# EAGLE design water_project (EAGLE 9.4.2)
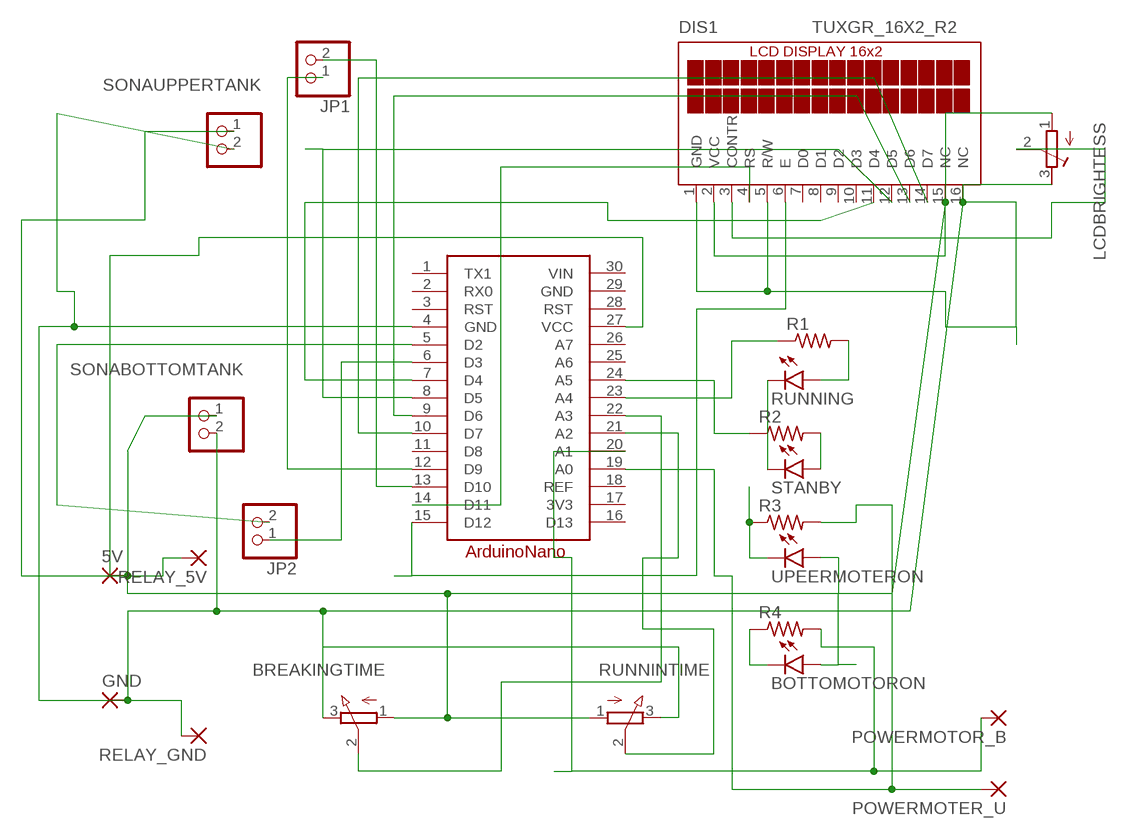
[diagram p0: schematic, sheet 1]

## Parts
5V  3,17/1,3  [3,17/1,3]
A1  ARDUINONANO  [ARDUINONANO]
BOTTOMOTORON  LEDSFH480  [SFH480]
BREAKINGTIME  3RP/1610N  [3RP/1610N]
DIS1  TUXGR_16X2_R2  [TUXGR_16X2_R2]
GND  3,17/1,3  [3,17/1,3]
JP1  PINHD-1X2  [1X02]
JP2  PINHD-1X2  [1X02]
LCDBRIGHTESS  R-TRIMM3339P  [RTRIM3339P]
POWERMOTER_U  3,17/1,3  [3,17/1,3]
POWERMOTOR_B  3,17/1,3  [3,17/1,3]
R1  R-US_0207/7  [0207/7]
R2  R-US_0207/7  [0207/7]
R3  R-US_0207/7  [0207/7]
R4  R-US_0207/7  [0207/7]
RELAY_5V  3,17/1,3  [3,17/1,3]
RELAY_GND  3,17/1,3  [3,17/1,3]
RUNNING  LEDSFH480  [SFH480]
RUNNINTIME  3RP/1610N  [3RP/1610N]
SONABOTTOMTANK  PINHD-1X2  [1X02]
SONAUPPERTANK  PINHD-1X2  [1X02]
STANBY  LEDSFH480  [SFH480]
UPEERMOTERON  LEDSFH480  [SFH480]

## Nets
ECHO: A1.13(D10) JP1.2
ECHO1: A1.5(D2) JP2.2
GND: A1.4(GND) BREAKINGTIME.3(E) DIS1.1(GND) DIS1.5(R/W) DIS1.16(NC) GND.1(P) LCDBRIGHTESS.3(E) RELAY_GND.1(P) RUNNINTIME.3(E) SONABOTTOMTANK.2 SONAUPPERTANK.2
N$1: R1.2 RUNNING.A
N$2: R2.2 STANBY.A
N$3: BOTTOMOTORON.K(C) R4.1
N$5: DIS1.3(CONTR) LCDBRIGHTESS.2(S)
N$6: A1.7(D4) DIS1.11(D4)
N$7: A1.8(D5) DIS1.12(D5)
N$8: A1.9(D6) DIS1.13(D6)
N$9: A1.10(D7) DIS1.14(D7)
N$10: RUNNING.K(C) STANBY.K(C)
N$11: A1.14(D11) DIS1.4(RS)
N$12: A1.15(D12) DIS1.6(E)
N$15: A1.21(A2) RUNNINTIME.2(S)
N$16: A1.22(A3) BREAKINGTIME.2(S)
N$17: A1.19(A0) POWERMOTER_U.1(P) R3.2
N$18: A1.20(A1) POWERMOTOR_B.1(P) R4.2
N$19: A1.23(A4) R1.1
N$20: A1.24(A5) R2.1
N$21: R3.1 UPEERMOTERON.K(C)
TRIG: A1.12(D9) JP1.1
TRIG1: A1.6(D3) JP2.1
VCC: 5V.1(P) A1.27(VCC) BOTTOMOTORON.A BREAKINGTIME.1(A) DIS1.2(VCC) DIS1.15(NC) LCDBRIGHTESS.1(A) RELAY_5V.1(P) RUNNINTIME.1(A) SONABOTTOMTANK.1 SONAUPPERTANK.1 UPEERMOTERON.A
Unconnected: A1.1(TX1) A1.2(RX0) A1.3(RST) A1.11(D8) A1.16(D13) A1.25(A6) A1.26(A7) A1.28(RST) DIS1.7(D0) DIS1.8(D1) DIS1.9(D2) DIS1.10(D3)

## Power pins joined to a net without a drawn wire
3V3: A1.17(3V3)
GND: A1.29(GND)
REF: A1.18(REF)
VIN: A1.30(VIN)

## Library data of the parts
5V GND POWERMOTER_U POWERMOTOR_B RELAY_5V RELAY_GND = wirepad:3,17/1,3: THROUGH-HOLE PAD
A1 = ArduinoNano:ARDUINONANO
BOTTOMOTORON RUNNING STANBY UPEERMOTERON = led:LED: LED OSRAM: - CHIPLED LG R971, LG N971, LY N971, LG Q971, LY Q971, LO R971, LY R971 LH N974, LH R974 LS Q976, LO Q976, LY Q976 LO Q996 - Hyper CHIPLED LW Q18S LB Q993, LB Q99A, LB R99A - SideLED LS A670, LO A670, LY A670, LG A670, LP A670 LB A673, LV A673, LT A673, LW A673 LH A674 LY A675 LS A676, LA A676, LO A676, LY A676, LW A676 LS A679, LY A679, LG A679 - Hyper Micro SIDELED® LS Y876, LA Y876, LO Y876, LY Y876 LT Y87S - SmartLED LW L88C, LW L88S LB L89C, LB L89S, LG L890 LS L89K, LO L89K, LY L89K LS L896, LA L896, LO L896, LY L896 - TOPLED LS T670, LO T670, LY T670, LG T670, LP T670 LSG T670, LSP T670, LSY T670, LOP T670, LYG T670 LG T671, LOG T671, LSG T671 LB T673, LV T673, LT T673, LW T673 LH T674 LS T676, LA T676, LO T676, LY T676, LB T676, LH T676, LSB T676, LW T676 LB T67C, LV T67C, LT T67C, LS T67K, LO T67K, LY T67K, LW E67C LS E67B, LA E67B, LO E67B, LY E67B, LB E67C, LV E67C, LT E67C LW T67C LS T679, LY T679, LG T679 LS T770, LO T770, LY T770, LG T770, LP T770 LB T773, LV T773, LT T773, LW T773 LH T774 LS E675, LA E675, LY E675, LS T675 LS T776, LA T776, LO T776, LY T776, LB T776 LHGB T686 LT T68C, LB T68C - Hyper Mini TOPLED® LB M676 - Mini TOPLED Santana® LG M470 LS M47K, LO M47K, LY M47K Source: http://www.osram.convergy.de LUXEON: - LUMILED® LXK2-PW12-R00, LXK2-PW12-S00, LXK2-PW14-U00, LXK2-PW14-V00 LXK2-PM12-R00, LXK2-PM12-S00, LXK2-PM14-U00 LXK2-PE12-Q00, LXK2-PE12-R00, LXK2-PE12-S00, LXK2-PE14-T00, LXK2-PE14-U00 LXK2-PB12-K00, LXK2-PB12-L00, LXK2-PB12-M00, LXK2-PB14-N00, LXK2-PB14-P00, LXK2-PB14-Q00 LXK2-PR12-L00, LXK2-PR12-M00, LXK2-PR14-Q00, LXK2-PR14-R00 LXK2-PD12-Q00, LXK2-PD12-R00, LXK2-PD12-S00 LXK2-PH12-R00, LXK2-PH12-S00 LXK2-PL12-P00, LXK2-PL12-Q00, LXK2-PL12-R00 Source: www.luxeon.com KINGBRIGHT: KA-3528ASYC Source: www.kingbright.com
BREAKINGTIME RUNNINTIME = pot:3RP/1610N: 16mm Potentiometer one level Source: http://www.alphapotentiometers.net/html/16mm_pot_2.html
DIS1 = display-lcd:TUXGR_16X2_R2: Tuxgraphics LCD display 16x2 characters reflective, without background light Source: tuxgr_12x2_r2.pdf; OC_FARNELL: unknown; OC_NEWARK: unknown
JP1 JP2 SONABOTTOMTANK SONAUPPERTANK = pinhead:PINHD-1X2: PIN HEADER
LCDBRIGHTESS = resistor:R-TRIMM: Trimm resistor
R1-R4 = resistor:R-US_: RESISTOR, American symbol

## Board
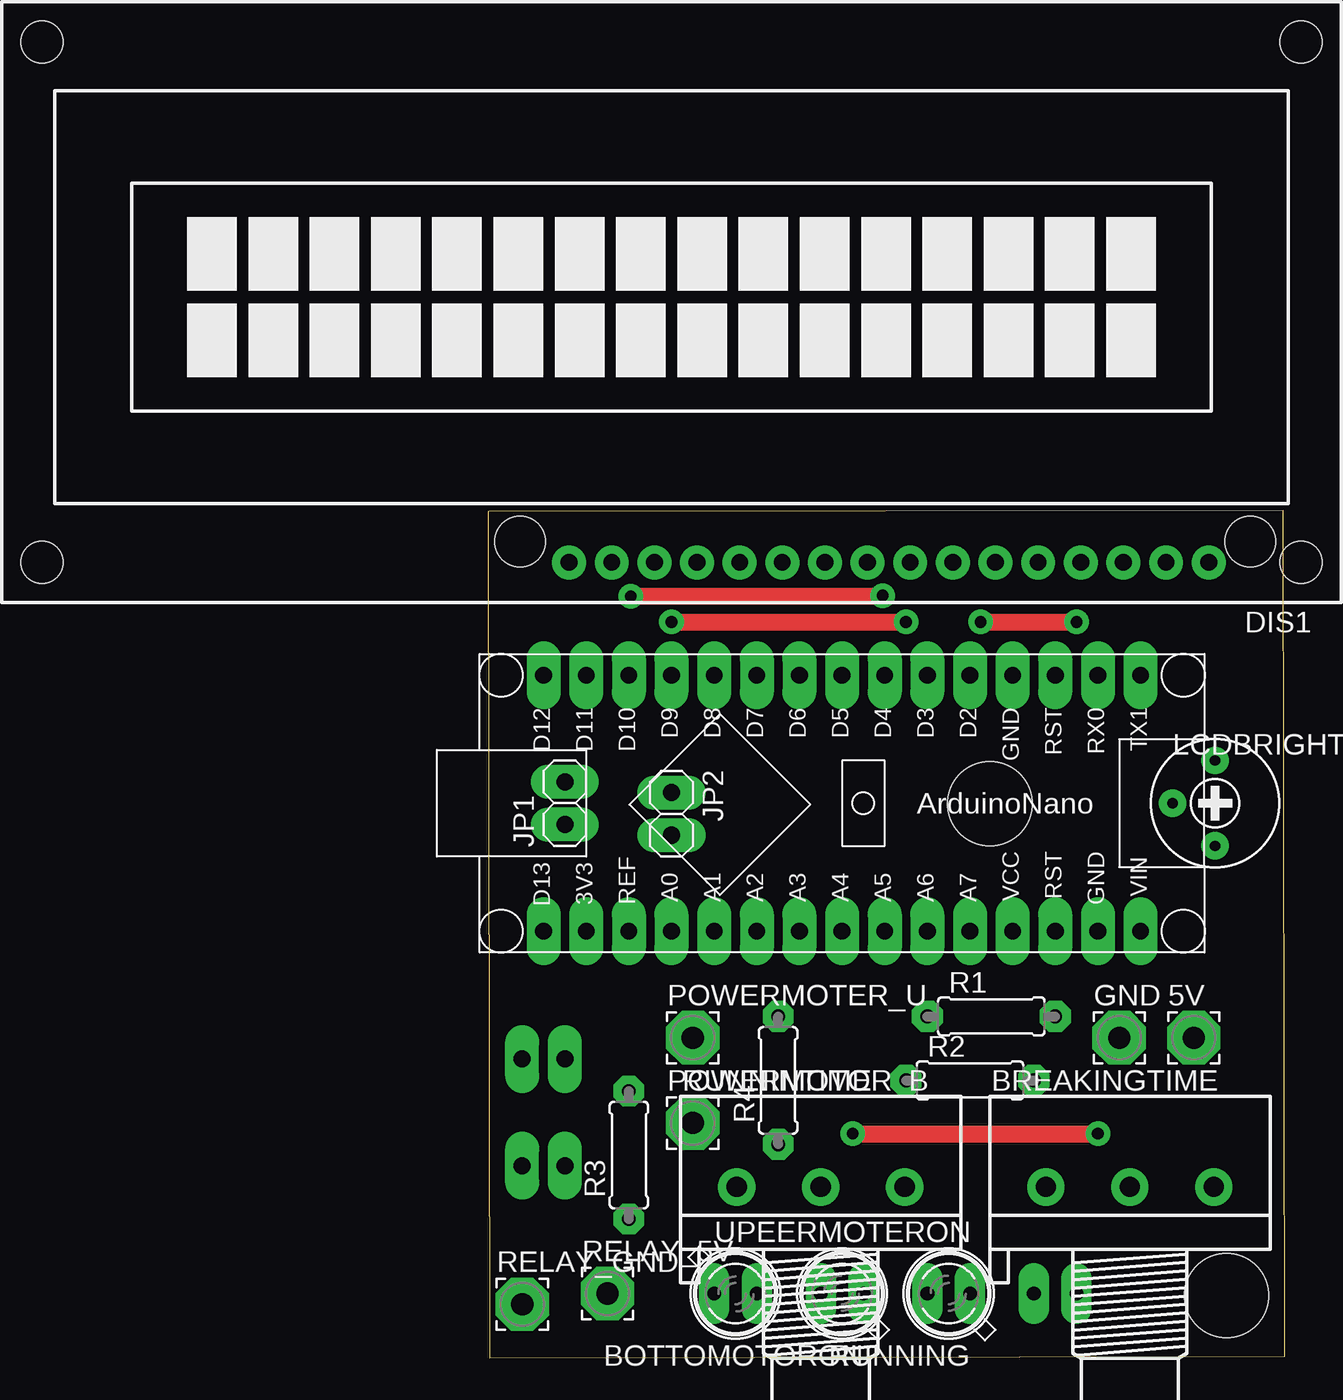
[diagram p1: board, top side]
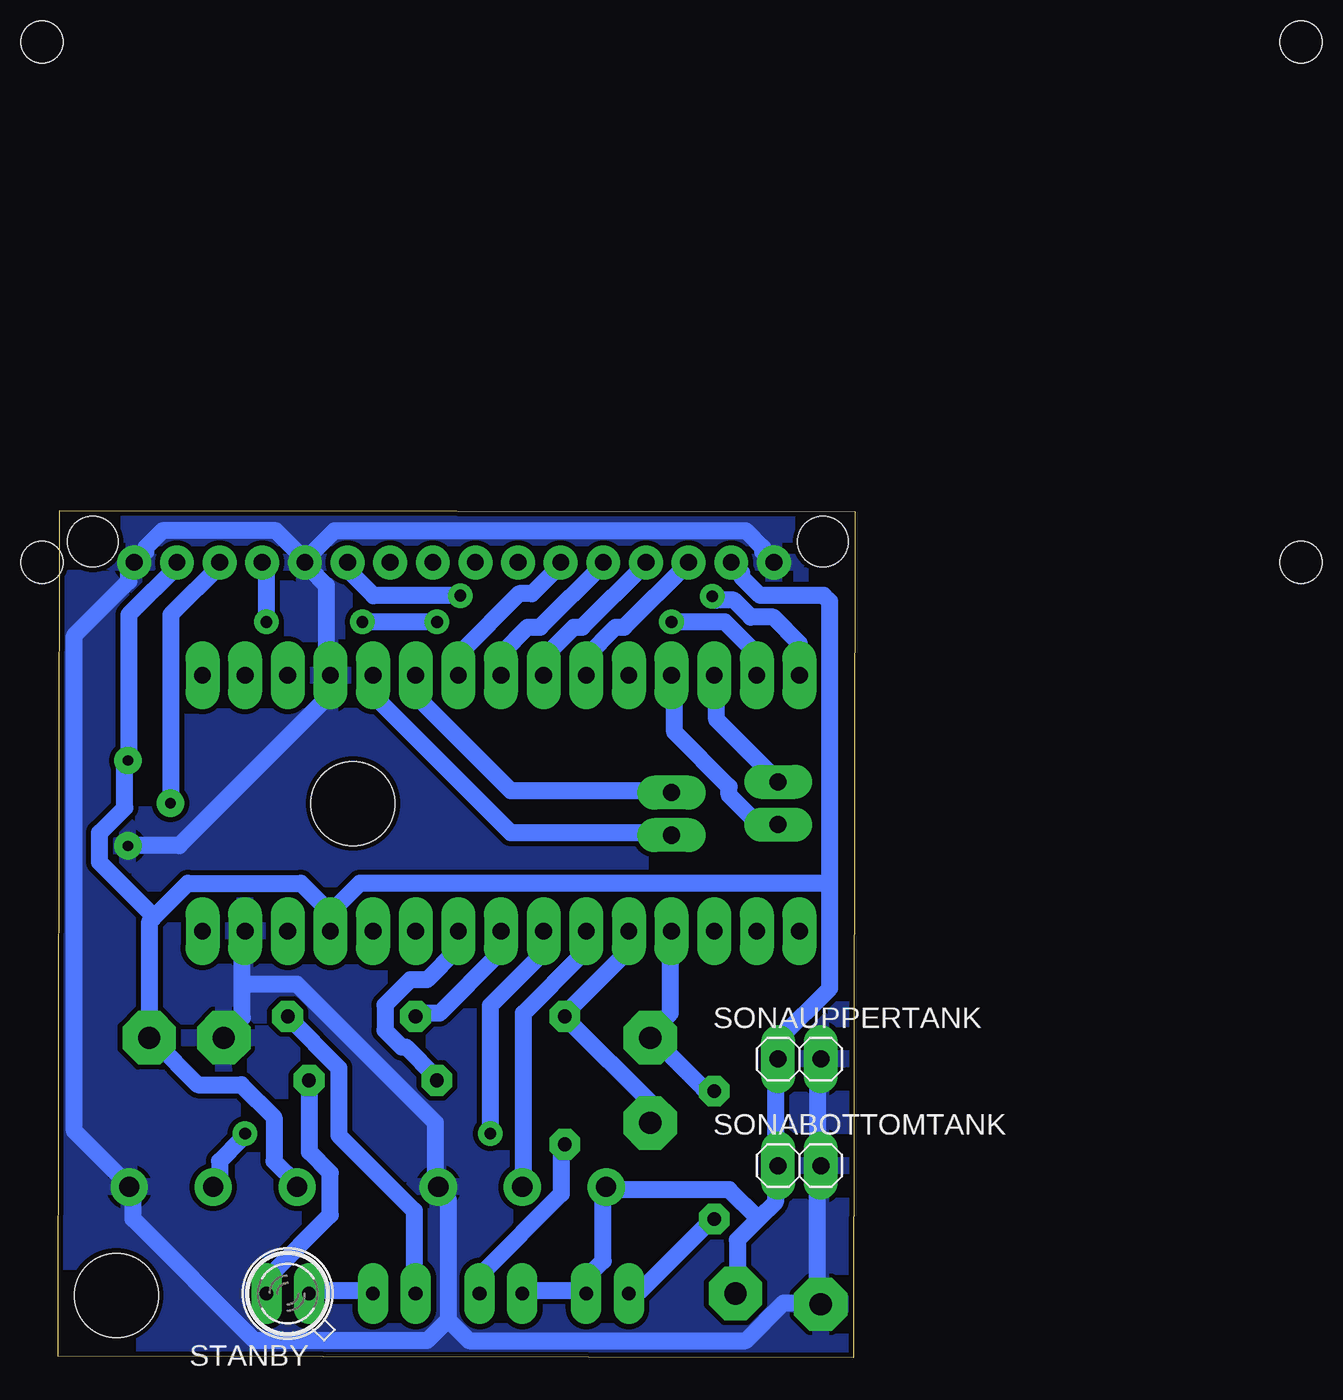
[diagram p2: board, bottom side, seen from below]

Size 47.47 x 50.45 mm. Coordinates in mm from the lower left corner, seen from the top.
Outline: 0.1,0 47.47,0.07 47.37,50.45 0,50.39 0.1,0
Copper layers (1*16): Top 0.035mm / dielectric 1.5mm / Bottom 0.035mm
Design rules "default *": minimum track width 1mm, minimum drill 0.5mm, track to track 0.3mm, track to pad 0.3mm, pad to pad 0.3mm, via to via 0.3mm, smd to smd 0.3mm, copper to edge 0.3mm, drill to drill 0.3mm, minimum pad ring 20mil, minimum via ring 15mil, stop-mask expansion 4mil, vias tented up to drill 0mil, thermal gap 10mil
Holes 3 mm at 1.9,48.6 45.4,48.6
Holes 5 mm at 44,3.7 29.9,33

### Footprints (pad centres in the part's own frame; a part is rotated, then mirrored left to right if it is on the bottom)
3,17/1,3 = drill 1.321 pad 3.175 octagon: 1 0,0
ARDUINONANO = drill 1 pad 1.575 long: 1 -7.62,16.51; 2 -7.62,13.97; 3 -7.62,11.43; 4 -7.62,8.89; 5 -7.62,6.35; 6 -7.62,3.81; 7 -7.62,1.27; 8 -7.62,-1.27; 9 -7.62,-3.81; 10 -7.62,-6.35; 11 -7.62,-8.89; 12 -7.62,-11.43; 13 -7.62,-13.97; 14 -7.62,-16.51; 15 -7.62,-19.05; 16 7.62,-19.05; 17 7.62,-16.51; 18 7.62,-13.97; 19 7.62,-11.43; 20 7.62,-8.89; 21 7.62,-6.35; 22 7.62,-3.81; 23 7.62,-1.27; 24 7.62,1.27; 25 7.62,3.81; 26 7.62,6.35; 27 7.62,8.89; 28 7.62,11.43; 29 7.62,13.97; 30 7.62,16.51
SFH480 = drill 0.813 long: A 1.27,0; K -1.27,0
3RP/1610N = drill 1.2 pad 2.184: 1 -5,0; 2 0,0; 3 5,0
TUXGR_16X2_R2 = drill 1 pad 1.676: 1 -32,15.5; 2 -29.46,15.5; 3 -26.92,15.5; 4 -24.38,15.5; 5 -21.84,15.5; 6 -19.3,15.5; 7 -16.76,15.5; 8 -14.22,15.5; 9 -11.68,15.5; 10 -9.14,15.5; 11 -6.6,15.5; 12 -4.06,15.5; 13 -1.52,15.5; 14 1.02,15.5; 15 3.56,15.5; 16 6.1,15.5 | hole 2.5: -37.5,-15.5; 37.5,-15.5; -37.5,15.5; 37.5,15.5
1X02 = drill 1.016 long: 1 -1.27,0; 2 1.27,0
RTRIM3339P = drill 0.61: 1 -2.54,0; 2 0,-2.54; 3 2.54,0
0207/7 = drill 0.813 octagon: 1 -3.81,0; 2 3.81,0

### Placement (x,y rotation side)
5V  42.05,19.05 0 top
A1  22.36,33.02 270 top
BOTTOMOTORON  21.09,3.81 180 top
BREAKINGTIME  38.23,10.16 0 top
DIS1  10.93,62.87 180 top
GND  37.6,19.05 0 top
JP1  4.58,33.02 90 top
JP2  10.93,32.38 270 top
LCDBRIGHTESS  43.31,33.02 270 top
POWERMOTER_U  12.2,19.05 0 top
POWERMOTOR_B  12.2,13.97 0 top
R1  29.98,20.32 0 top
R2  28.71,16.51 0 top
R3  8.39,12.06 90 top
R4  17.28,16.51 90 top
RELAY_5V  7.12,3.81 0 top
RELAY_GND  2.04,3.17 0 top
RUNNING  27.44,3.81 180 top
RUNNINTIME  19.82,10.16 0 top
SONABOTTOMTANK  3.31,11.43 0 bottom
SONAUPPERTANK  3.31,17.78 0 bottom
STANBY  33.79,3.81 180 bottom
UPEERMOTERON  14.74,3.81 0 top

### Tracks (layer width: path | path; a pad name or v marks a point on that pad's centre or on a via)
ECHO
  Bottom 1: A1.13 8.25,40.5 8.25,38 4.75,34.5 JP1.2
ECHO1
  Bottom 1: A1.5 28.5,40.5 28.5,39.25 20.5,31.25 11,31.25 JP2.2
GND
  Bottom 1: LCDBRIGHTESS.3 43.25,30.5 40.25,30.5 31.25,39.5 A1.4 31.5,41 31.5,46 32.5,47 DIS1.5 | DIS1.16 5,47.5 5.5,48 5.5,48.25 6.5,49.25 31,49.25 32.75,47.5 DIS1.5 | DIS1.5 33,47.75 34.5,49.25 41.25,49.25 42.25,48.25 42.25,48 42.75,47.5 DIS1.1 43.25,47 43.25,46.25 46.5,43 46.5,13.5 43.5,10.5 BREAKINGTIME.3 43,10 43,8.25 35.75,1 25.5,1 24.25,2.25 | SONAUPPERTANK.2 2.25,17.75 2.25,11.5 SONABOTTOMTANK.2 2.25,11 2.25,3.25 RELAY_GND.1 2.75,3.25 4.25,3.25 6.5,1 23,1 24.25,2.25 | 36.5,22.25 36.5,20.25 37.5,19.25 GND.1 | 36.5,22.25 36.5,25.25 A1.29 | 36.5,22.25 33.25,22.25 25,14 25,10.25 RUNNINTIME.3 24.5,9.75 24.25,9.5 24.25,2.25
  pour Bottom: -0.7,50.5 -0.7,-0.5 -1,-0.8 47.5,-0.8 47.9,-0.4 47.9,50.8 48.1,51 -0.2,51
N$1
  Bottom 1: RUNNING.A 26.25,4 26.25,8.75 30.75,13.25 30.75,17.25 33.75,20.25 R1.2
N$2
  Bottom 1: R2.2 32.5,16.5 32.5,12.25 31.25,11 31.25,8.5 35,4.75 35,4 STANBY.A
N$3
  Bottom 1: BOTTOMOTORON.K 22.25,4 22.25,5 17.5,9.75 17.5,12.5 R4.1
N$5
  Bottom 1: LCDBRIGHTESS.2 40.75,33.25 40.75,44.25 37.75,47.25 DIS1.3
N$6
  Bottom 1: DIS1.11 17.53,47.22 19.25,45.5 20,45.5 23.5,42 23.5,40.77 A1.7
N$7
  Bottom 1: A1.8 21,40.73 21,42 19.5,43.5 18.75,43.5 14.99,47.26 DIS1.12
N$8
  Bottom 1: A1.9 18.5,40.69 18.5,41.75 16.75,43.5 16.25,43.5 12.45,47.3 DIS1.13
N$9
  Bottom 1: A1.10 16,41.75 14.25,43.5 13.75,43.5 9.91,47.34 DIS1.14
N$10
  Bottom 1: RUNNING.K 28.75,4 32.5,4 STANBY.K
N$11  (via drill 0.7 pad 1.3)
  Top 1: v10.93,43.81 v24.9,43.81 | v29.34,43.81 v35.06,43.81
  Bottom 1: A1.14 5.85,41.91 7.76,43.81 v10.93,43.81 | v24.9,43.81 v29.34,43.81 | v35.06,43.81 35.06,47.12 DIS1.4
N$12  (via drill 0.7 pad 1.3)
  Top 1: v8.5,45.35 23.48,45.35 v23.51,45.39
  Bottom 1: A1.15 3.31,42.55 4.87,44.1 6.21,44.1 7.22,45.12 8.27,45.12 v8.5,45.35 | v23.51,45.39 28.69,45.39 30.23,46.93 DIS1.6
N$15
  Bottom 1: A1.21 16.25,25.25 16.25,24 19.75,20.5 19.75,10.25 RUNNINTIME.2
N$16  (via drill 0.7 pad 1.3)
  Top 1: v21.73,13.34 v36.33,13.34
  Bottom 1: A1.22 18.55,24.13 21.73,20.95 v21.73,13.34 | BREAKINGTIME.2 37.85,10.4 37.85,11.7 36.55,13 v36.33,13.34
N$17
  Bottom 1: R3.2 8.5,16 9,16 12,19 POWERMOTER_U.1 12,19.5 11,20.5 11,25.25 A1.19
N$18
  Bottom 1: A1.20 13.5,25.25 13.5,24.25 17.25,20.5 R4.2 17,20 12.25,15.25 12.25,14 POWERMOTOR_B.1
N$19
  Bottom 1: R1.1 26,20.5 24.75,20.5 21.25,24 21.25,25.25 A1.23
N$20
  Bottom 1: R2.1 25,16.75 26.75,18.5 27,18.5 28,19.5 28,21 26.5,22.5 25.5,22.5 23.75,24.25 23.75,25.25 A1.24
N$21
  Bottom 1: UPEERMOTERON.K 13.25,4 12.75,4 8.5,8.25 R3.1
TRIG
  Bottom 1: JP1.1 5.75,31.75 7.5,33.5 7.5,34 10.75,37.25 10.75,40.5 A1.12
TRIG1
  Bottom 1: A1.6 26,40.5 26,39.25 20.5,33.75 11,33.75 JP2.1
VCC
  Bottom 1: DIS1.2 40.25,47.25 43.25,44.25 43.25,35.75 LCDBRIGHTESS.1 43.5,35.25 43.5,32.75 45,31.25 45,29.5 41.75,26.25 | 41.75,26.25 42,26 42,19.25 5V.1 41.75,18.85 39.15,16.25 36.55,16.25 34.6,14.3 34.6,11.7 33.3,10.4 BREAKINGTIME.1 | 41.75,26.25 39.75,28.25 33,28.25 31.25,26.5 A1.27 31,26.75 29.5,28.25 1.5,28.25 | BOTTOMOTORON.A 19.75,4 16.25,4 UPEERMOTERON.A 16.25,4.5 15,5.75 15,10 RUNNINTIME.1 14.5,10 7.5,10 5.75,8.25 | 1.5,28.25 1.5,22 4.5,19 4.5,18 SONAUPPERTANK.1 4.75,17.5 4.75,11.5 SONABOTTOMTANK.1 4.75,11 4.75,9.25 5.75,8.25 | 1.5,28.25 1.5,45.04 1.87,45.41 5.66,45.41 6.75,46.5 6.75,46.75 7.25,47.25 DIS1.15 | 5.75,8.25 7,7 7,4 RELAY_5V.1